# Altium schematic sheet Power_Dist.SchDoc
size A
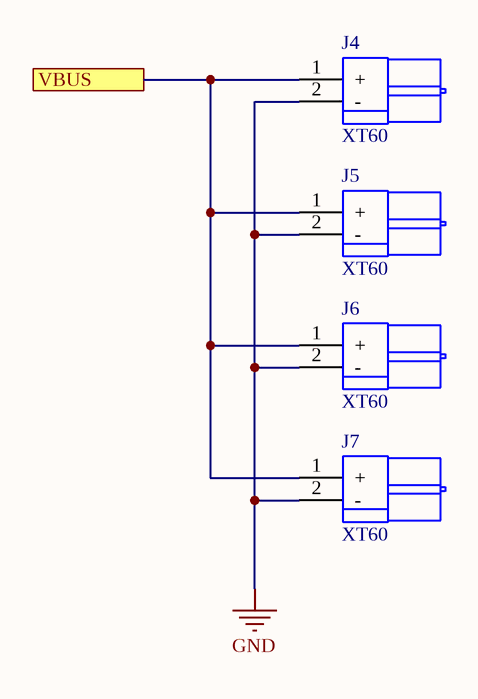
[diagram p0: Power_Dist.SchDoc]

## Parts
J4  XT60  [J_XT60_Thru_Female]
J5  XT60  [J_XT60_Thru_Female]
J6  XT60  [J_XT60_Thru_Female]
J7  XT60  [J_XT60_Thru_Female]

## Ports
VBUS

## Nets
GND: J4.2(-) J5.2(-) J6.2(-) J7.2(-)
VBUS: J4.1(+) J5.1(+) J6.1(+) J7.1(+) ; port VBUS

## Library data of the parts
J4-J7 = J_XT60: 60 Amp XT60 Connector